# EAGLE design remote board (EAGLE 6.2)
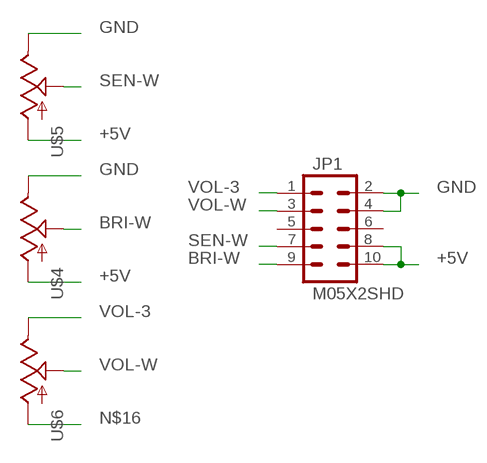
[diagram p0: schematic, sheet 1]

## Parts
JP1  M05X2SHD  [2X5-SHROUDED]
U$4  POT100K_3362U  [3362U]
U$5  POT100K_3362U  [3362U]
U$6  POT100K_3362U  [3362U]

## Nets
+5V: JP1.8 JP1.10 U$4.P$3(A) U$5.P$3(A)
BRI-W: JP1.9 U$4.P$2(S)
GND: JP1.2 JP1.4 U$4.P$1(E) U$5.P$1(E)
N$16: U$6.P$3(A)
SEN-W: JP1.7 U$5.P$2(S)
VOL-3: JP1.1 U$6.P$1(E)
VOL-W: JP1.3 U$6.P$2(S)
Unconnected: JP1.5 JP1.6

## Library data of the parts
JP1 = SparkFun:M05X2: Header 5x2 Standard 10-pin dual row 0.1" header. Commonly used with AVR-ISP. Use with Spark Fun Electronics SKU: PRT-00778
U$4-U$6 = SparkFun:POT

## Board
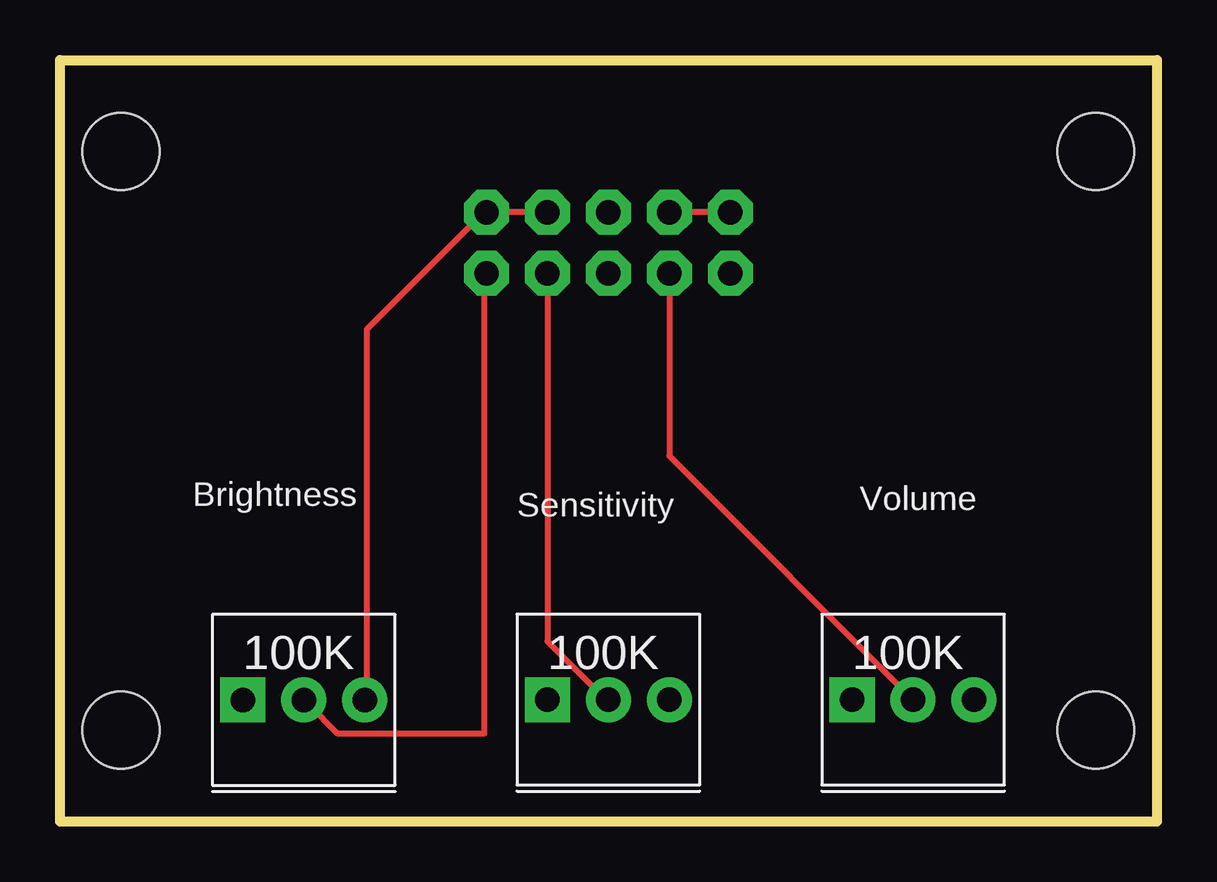
[diagram p1: board, top side]
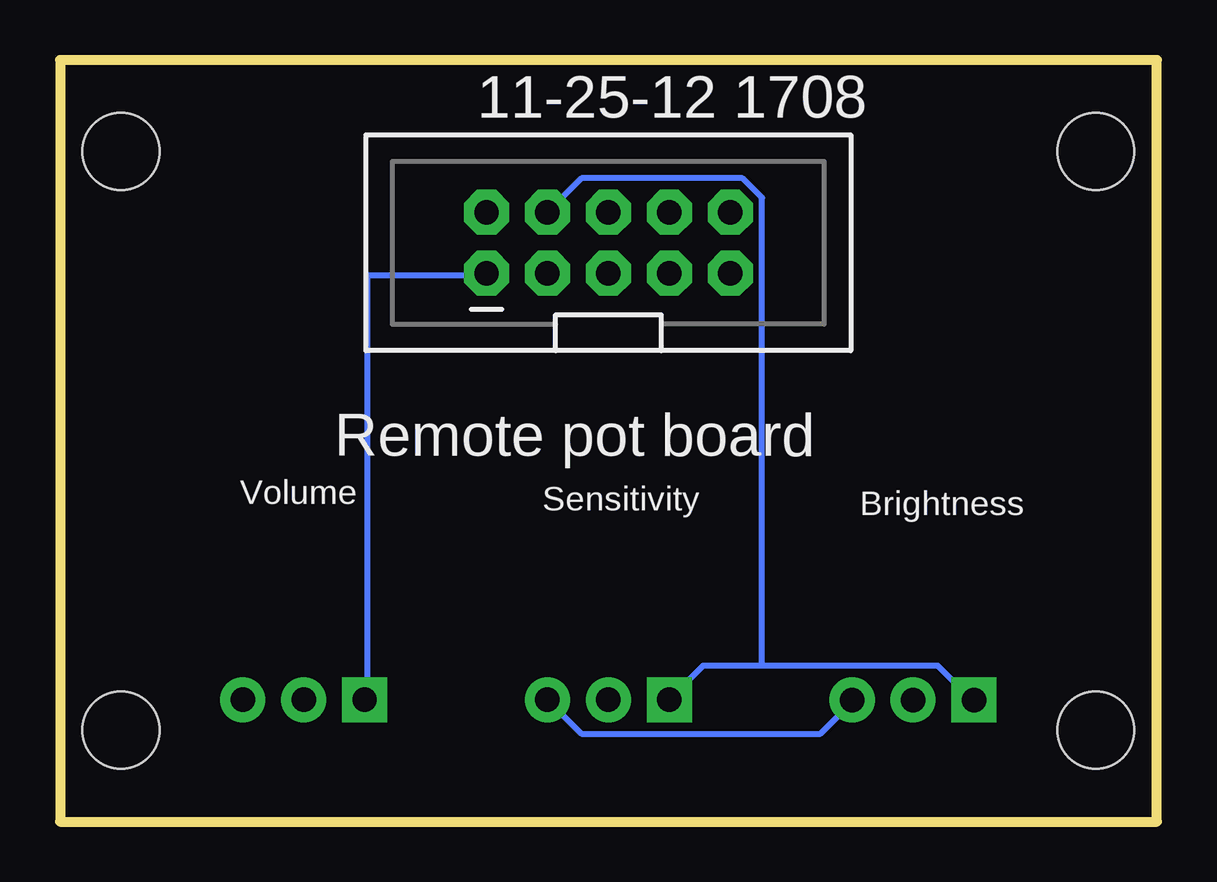
[diagram p2: board, bottom side, seen from below]

Size 45.72 x 31.75 mm. Coordinates in mm from the lower left corner, seen from the top.
Outline: 0,0 0,31.75 45.72,31.75 45.72,0 0,0
Copper layers (1*16): Top 0.035mm / dielectric 1.5mm / Bottom 0.035mm
Design rules: minimum track width 10mil, minimum drill 24mil, track to track 8mil, track to pad 8mil, pad to pad 8mil, via to via 8mil, smd to smd 8mil, copper to edge 40mil, drill to drill 8mil, minimum pad ring 10mil, minimum via ring 8mil, stop-mask expansion 4mil, vias tented up to drill 0mil, thermal gap 10mil
Holes 3.2 mm at 2.54,3.81 43.18,3.81 43.18,27.94 2.54,27.94

### Footprints (pad centres in the part's own frame; a part is rotated, then mirrored left to right if it is on the bottom)
2X5-SHROUDED = drill 1.016 pad 1.88 octagon: 1 -1.27,5.08; 2 1.27,5.08; 3 -1.27,2.54; 4 1.27,2.54; 5 -1.27,0; 6 1.27,0; 7 -1.27,-2.54; 8 1.27,-2.54; 9 -1.27,-5.08; 10 1.27,-5.08
3362U = drill 1.016 pad 1.88 square: P$1 0,2.54 | drill 1.016 pad 1.88: P$2 2.54,2.54; P$3 5.08,2.54

### Placement (x,y rotation side)
JP1  22.86,24.13 90 bottom
U$4  7.62,2.53 0 top
U$5  20.32,2.54 0 top
U$6  33.02,2.54 0 top

### Tracks (layer width: path | path; a pad name or v marks a point on that pad's centre or on a via)
+5V
  Top 0.254: JP1.8 17.88,25.4 JP1.10 17.68,25.4 12.8,20.52 12.8,5.08 U$4.P$3
  Bottom 0.254: U$5.P$3 23.98,3.66 14.02,3.66 12.8,4.88 U$4.P$3
BRI-W
  Top 0.254: U$4.P$2 10.36,4.88 11.58,3.66 17.68,3.66 17.68,22.76 JP1.9
GND
  Top 0.254: JP1.4 27.84,25.4 JP1.2
  Bottom 0.254: 16.46,6.5 18.9,6.5 U$5.P$1 | 16.46,6.5 9.14,6.5 7.72,5.08 U$4.P$1 | JP1.4 23.98,26.82 17.27,26.82 16.46,26.01 16.46,6.5
SEN-W
  Top 0.254: U$5.P$2 22.76,5.08 20.32,7.52 20.32,22.76 JP1.7
VOL-3
  Bottom 0.254: U$6.P$1 32.92,5.08 32.92,22.76 28.04,22.76 JP1.1
VOL-W
  Top 0.254: U$6.P$2 25.4,15.24 25.4,22.76 JP1.3

### Text on the board
tPlace: Brightness | Sensitivity | Volume | 100K | 100K | 100K
bPlace: 11-25-12 1708 | Remote pot board | Brightness | Sensitivity | Volume